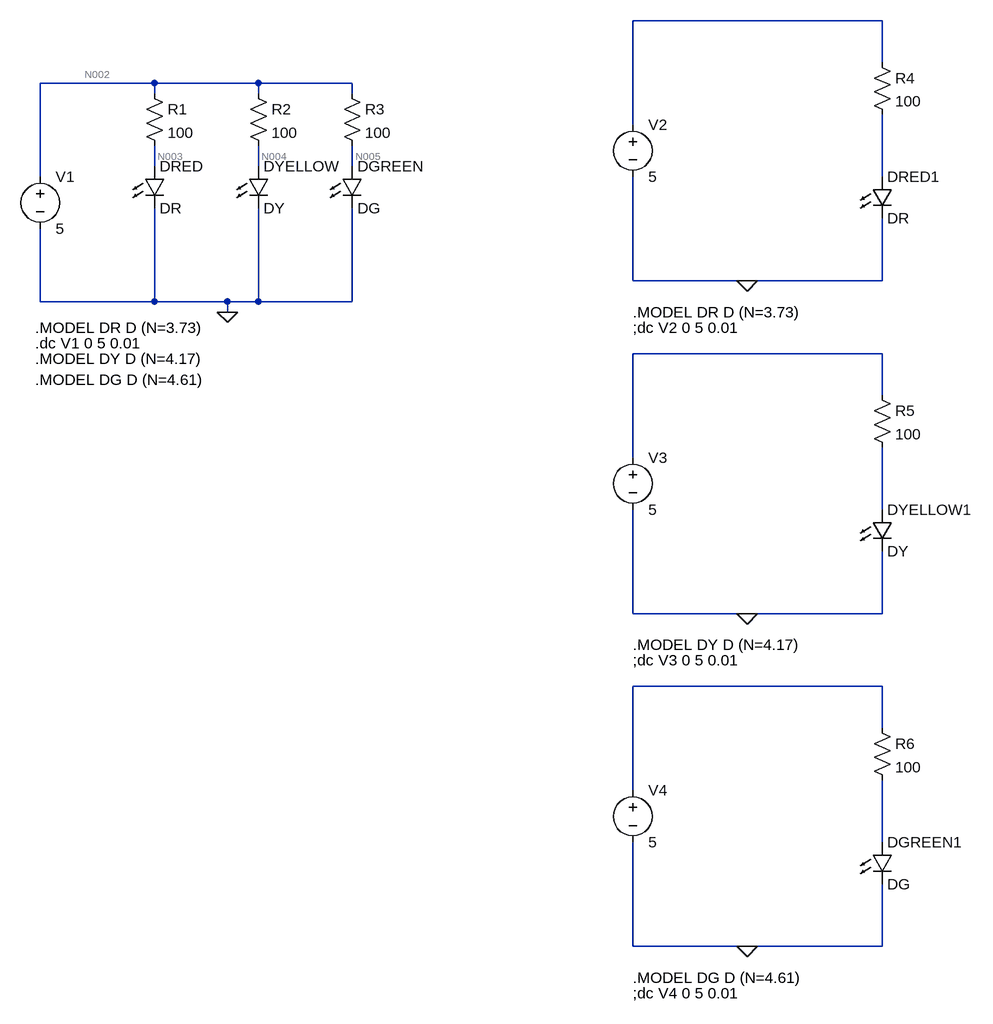
[diagram p0: schematic led_simulation.asc]
led_simulation.asc, the LTspice schematic file:
Version 4
SHEET 1 1500 1352
WIRE 1360 -160 976 -160
WIRE 1360 -96 1360 -160
WIRE 240 -64 64 -64
WIRE 400 -64 240 -64
WIRE 544 -64 400 -64
WIRE 240 -48 240 -64
WIRE 400 -48 400 -64
WIRE 544 -48 544 -64
WIRE 976 0 976 -160
WIRE 240 64 240 32
WIRE 400 64 400 32
WIRE 544 64 544 32
WIRE 64 80 64 -64
WIRE 1360 80 1360 -16
WIRE 976 240 976 80
WIRE 1152 240 976 240
WIRE 1360 240 1360 144
WIRE 1360 240 1152 240
WIRE 64 272 64 160
WIRE 240 272 240 128
WIRE 240 272 64 272
WIRE 352 272 240 272
WIRE 400 272 400 128
WIRE 400 272 352 272
WIRE 544 272 544 128
WIRE 544 272 400 272
WIRE 352 288 352 272
WIRE 1360 352 976 352
WIRE 1360 416 1360 352
WIRE 976 512 976 352
WIRE 1360 592 1360 496
WIRE 976 752 976 592
WIRE 1152 752 976 752
WIRE 1360 752 1360 656
WIRE 1360 752 1152 752
WIRE 1360 864 976 864
WIRE 1360 928 1360 864
WIRE 976 1024 976 864
WIRE 1360 1104 1360 1008
WIRE 976 1264 976 1104
WIRE 1152 1264 976 1264
WIRE 1360 1264 1360 1168
WIRE 1360 1264 1152 1264
FLAG 352 288 0
FLAG 1152 240 0
FLAG 1152 752 0
FLAG 1152 1264 0
SYMBOL res 224 -64 R0
SYMATTR InstName R1
SYMATTR Value 100
SYMBOL res 384 -64 R0
SYMATTR InstName R2
SYMATTR Value 100
SYMBOL res 528 -64 R0
SYMATTR InstName R3
SYMATTR Value 100
SYMBOL LED 224 64 R0
SYMATTR InstName DRED
SYMATTR Value DR
SYMBOL LED 384 64 R0
SYMATTR InstName DYELLOW
SYMATTR Value DY
SYMBOL LED 528 64 R0
SYMATTR InstName DGREEN
SYMATTR Value DG
SYMBOL voltage 64 64 R0
WINDOW 123 0 0 Left 0
WINDOW 39 0 0 Left 0
SYMATTR InstName V1
SYMATTR Value 5
SYMBOL voltage 976 -16 R0
WINDOW 123 0 0 Left 0
WINDOW 39 24 124 Left 2
SYMATTR InstName V2
SYMATTR Value 5
SYMBOL res 1344 -112 R0
SYMATTR InstName R4
SYMATTR Value 100
SYMBOL LED 1344 80 R0
SYMATTR InstName DRED1
SYMATTR Value DR
SYMBOL voltage 976 496 R0
WINDOW 123 0 0 Left 0
WINDOW 39 24 124 Left 2
SYMATTR InstName V3
SYMATTR Value 5
SYMBOL res 1344 400 R0
SYMATTR InstName R5
SYMATTR Value 100
SYMBOL LED 1344 592 R0
SYMATTR InstName DYELLOW1
SYMATTR Value DY
SYMBOL voltage 976 1008 R0
WINDOW 123 0 0 Left 0
WINDOW 39 24 124 Left 2
SYMATTR InstName V4
SYMATTR Value 5
SYMBOL res 1344 912 R0
SYMATTR InstName R6
SYMATTR Value 100
SYMBOL LED 1344 1104 R0
SYMATTR InstName DGREEN1
SYMATTR Value DG
TEXT 56 312 Left 2 !.MODEL DR D (N=3.73)
TEXT 56 360 Left 2 !.MODEL DY D (N=4.17)
TEXT 56 392 Left 2 !.MODEL DG D (N=4.61)
TEXT 976 288 Left 2 !.MODEL DR D (N=3.73)
TEXT 976 312 Left 2 !;dc V2 0 5 0.01
TEXT 56 336 Left 2 !.dc V1 0 5 0.01
TEXT 976 800 Left 2 !.MODEL DY D (N=4.17)
TEXT 976 824 Left 2 !;dc V3 0 5 0.01
TEXT 976 1312 Left 2 !.MODEL DG D (N=4.61)
TEXT 976 1336 Left 2 !;dc V4 0 5 0.01

The netlist it stands for:
* led_simulation.asc
R1 N002 N003 100
R2 N002 N004 100
R3 N002 N005 100
DRED N003 0 DR
DYELLOW N004 0 DY
DGREEN N005 0 DG
V1 N002 0 5
V2 N001 0 5
R4 N001 N006 100
DRED1 N006 0 DR
V3 N007 0 5
R5 N007 N008 100
DYELLOW1 N008 0 DY
V4 N009 0 5
R6 N009 N010 100
DGREEN1 N010 0 DG
.model D D
.lib standard.dio
.MODEL DR D (N=3.73)
.MODEL DY D (N=4.17)
.MODEL DG D (N=4.61)
.MODEL DR D (N=3.73)
;dc V2 0 5 0.01
.dc V1 0 5 0.01
.MODEL DY D (N=4.17)
;dc V3 0 5 0.01
.MODEL DG D (N=4.61)
;dc V4 0 5 0.01
.backanno
.end

* Results of the author's LTspice run, read from the files saved beside the schematic
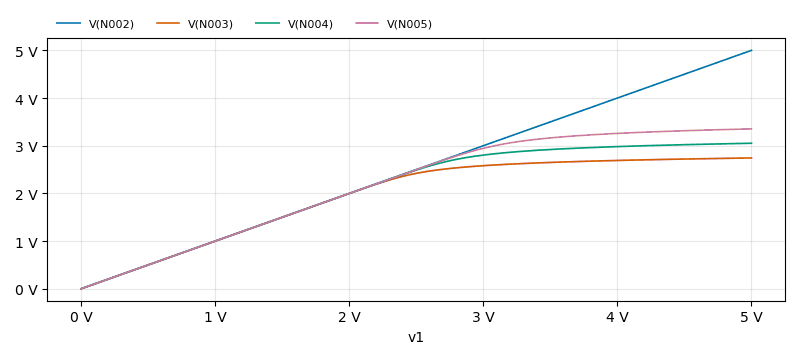
[diagram p1: DC transfer characteristic of led_simulation.asc, plotted from the saved traces]
* DC transfer characteristic, 1 run:
*   V(N002): 0 V at v1=0 V, 5 V at v1=5 V, min 0 V, max 5 V
*   V(N003): 6.395e-16 fV at v1=0 V, 2.744 V at v1=5 V, min 6.395e-16 fV, max 2.744 V
*   V(N004): 4.605e-16 fV at v1=0 V, 3.052 V at v1=5 V, min 4.605e-16 fV, max 3.052 V
*   V(N005): 3.423e-16 fV at v1=0 V, 3.354 V at v1=5 V, min 3.423e-16 fV, max 3.354 V